# Altium schematic sheet Connector_ADC_Side.SchDoc
size B; Author: AVD; CompanyName: Pi-Radio; SheetNumber: 2; SheetTotal: 13
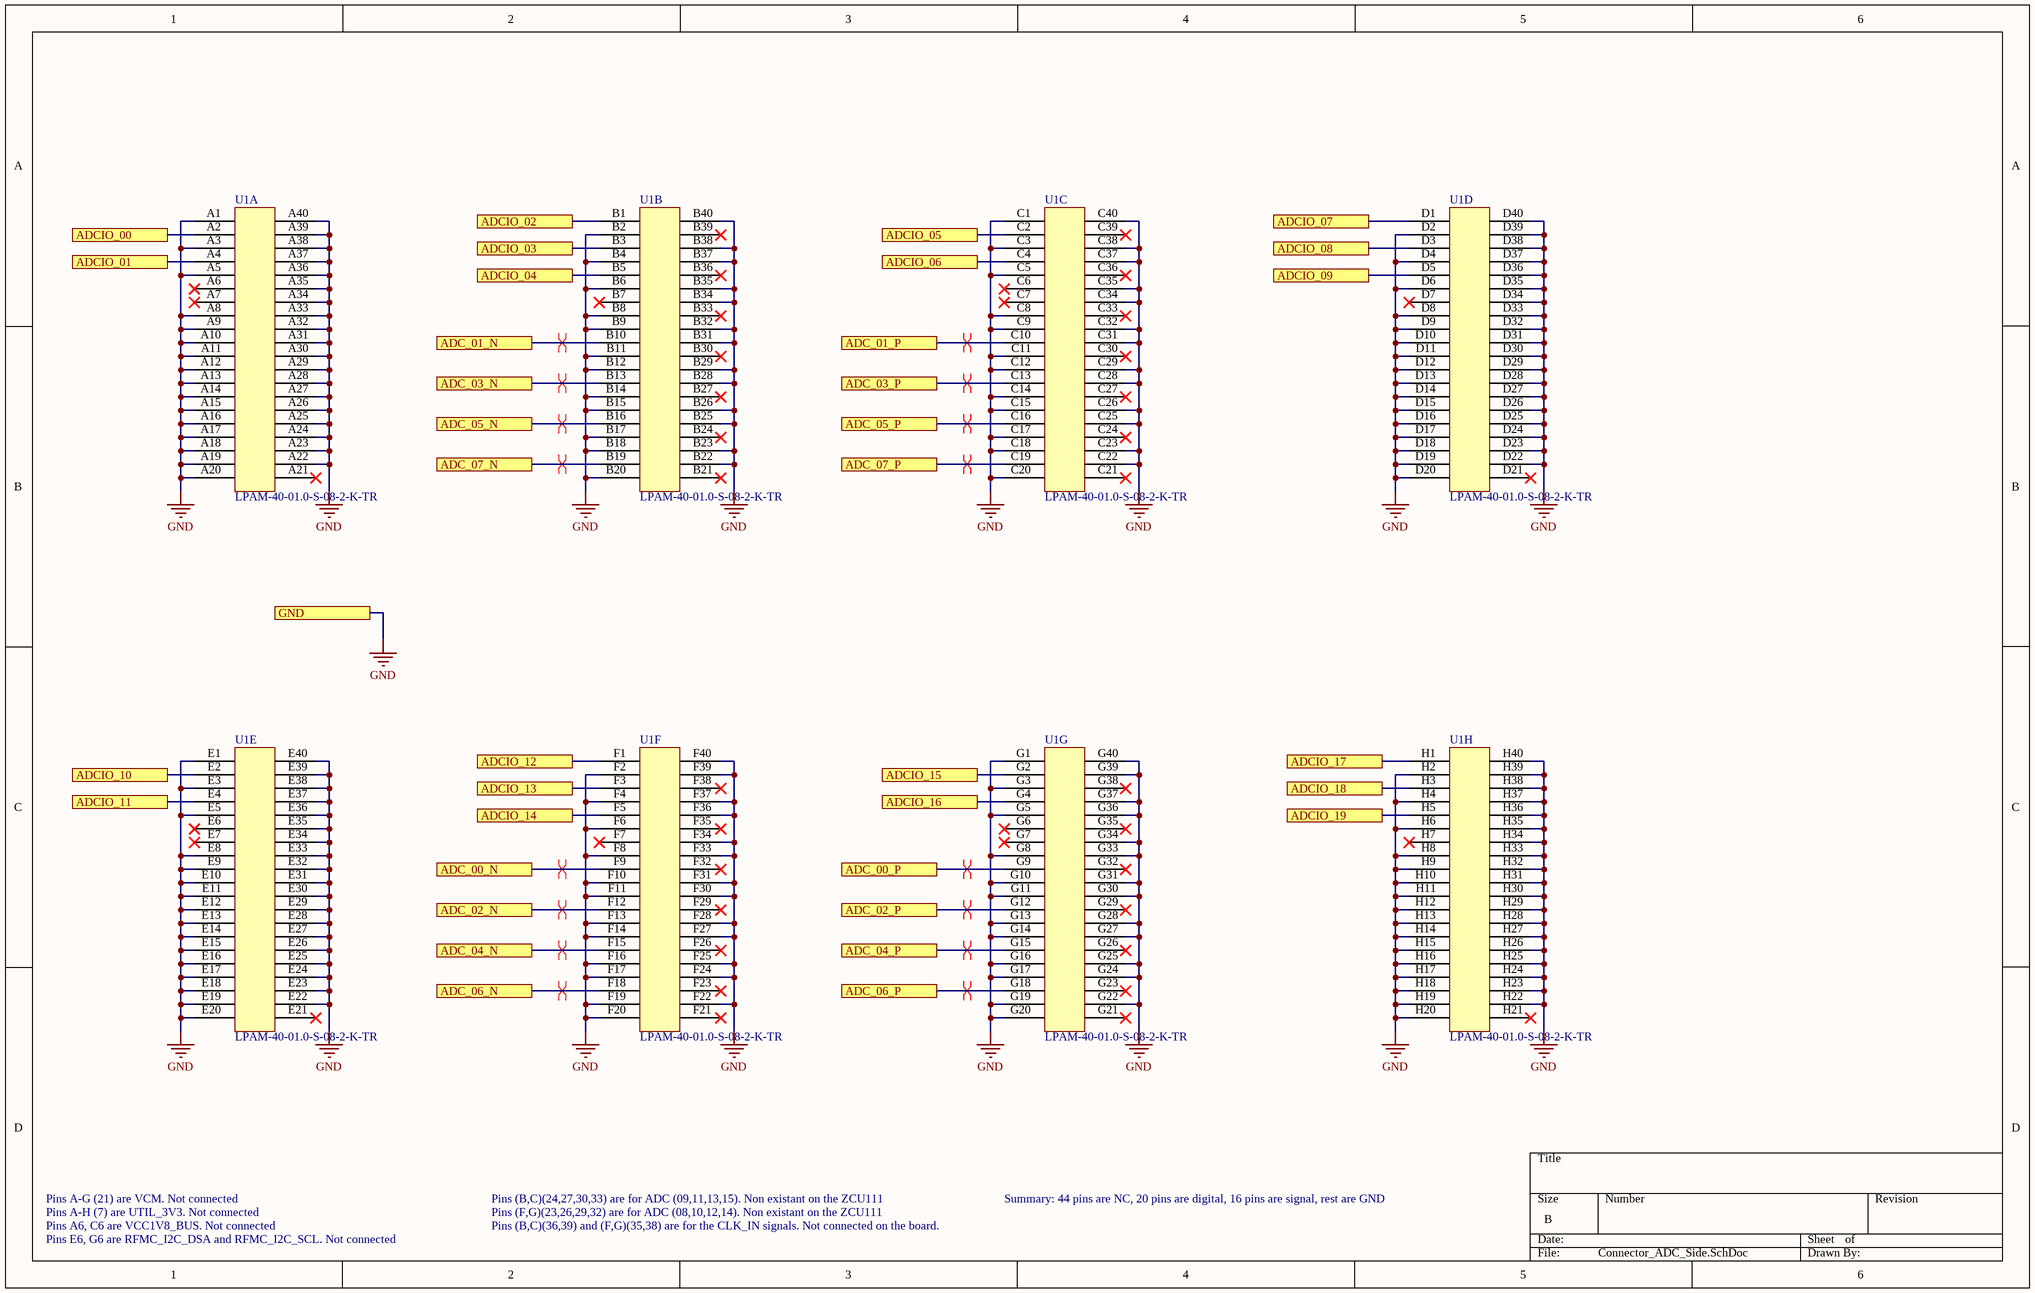
[diagram p0: Connector_ADC_Side.SchDoc]

## Parts
U1  LPAM-40-01.0-S-08-2-K-TR  [LPAM-40-01.5-S-08-2-K-TR]  (parts A,B,C,D,E,F,G,H of 8)

## Ports
ADC_00_N, ADC_00_P, ADC_01_N, ADC_01_P, ADC_02_N, ADC_02_P, ADC_03_N, ADC_03_P, ADC_04_N, ADC_04_P, ADC_05_N, ADC_05_P, ADC_06_N, ADC_06_P, ADC_07_N, ADC_07_P, ADCIO_00, ADCIO_01, ADCIO_02, ADCIO_03, ADCIO_04, ADCIO_05, ADCIO_06, ADCIO_07, ADCIO_08, ADCIO_09, ADCIO_10, ADCIO_11, ADCIO_12, ADCIO_13, ADCIO_14, ADCIO_15, ADCIO_16, ADCIO_17, ADCIO_18, ADCIO_19, GND

## Nets
GND: U1.A1 U1.A3 U1.A5 U1.A8 U1.A9 U1.A10 U1.A11 U1.A12 U1.A13 U1.A14 U1.A15 U1.A16 U1.A17 U1.A18 U1.A19 U1.A20 U1.A22 U1.A23 U1.A24 U1.A25 U1.A26 U1.A27 U1.A28 U1.A29 U1.A30 U1.A31 U1.A32 U1.A33 U1.A34 U1.A35 U1.A36 U1.A37 U1.A38 U1.A39 U1.A40 U1.B2 U1.B4 U1.B6 U1.B8 U1.B9 U1.B11 U1.B12 U1.B14 U1.B15 U1.B17 U1.B18 U1.B20 U1.B22 U1.B23 U1.B25 U1.B26 U1.B28 U1.B29 U1.B31 U1.B32 U1.B34 U1.B35 U1.B37 U1.B38 U1.B40 U1.C1 U1.C3 U1.C5 U1.C8 U1.C9 U1.C11 U1.C12 U1.C14 U1.C15 U1.C17 U1.C18 U1.C20 U1.C22 U1.C23 U1.C25 U1.C26 U1.C28 U1.C29 U1.C31 U1.C32 U1.C34 U1.C35 U1.C37 U1.C38 U1.C40 U1.D2 U1.D4 U1.D6 U1.D8 U1.D9 U1.D10 U1.D11 U1.D12 U1.D13 U1.D14 U1.D15 U1.D16 U1.D17 U1.D18 U1.D19 U1.D20 U1.D22 U1.D23 U1.D24 U1.D25 U1.D26 U1.D27 U1.D28 U1.D29 U1.D30 U1.D31 U1.D32 U1.D33 U1.D34 U1.D35 U1.D36 U1.D37 U1.D38 U1.D39 U1.D40 U1.E1 U1.E3 U1.E5 U1.E8 U1.E9 U1.E10 U1.E11 U1.E12 U1.E13 U1.E14 U1.E15 U1.E16 U1.E17 U1.E18 U1.E19 U1.E20 U1.E22 U1.E23 U1.E24 U1.E25 U1.E26 U1.E27 U1.E28 U1.E29 U1.E30 U1.E31 U1.E32 U1.E33 U1.E34 U1.E35 U1.E36 U1.E37 U1.E38 U1.E39 U1.E40 U1.F2 U1.F4 U1.F6 U1.F8 U1.F10 U1.F11 U1.F13 U1.F14 U1.F16 U1.F17 U1.F19 U1.F20 U1.F22 U1.F24 U1.F25 U1.F27 U1.F28 U1.F30 U1.F31 U1.F33 U1.F34 U1.F36 U1.F37 U1.F39 U1.F40 U1.G1 U1.G3 U1.G5 U1.G8 U1.G10 U1.G11 U1.G13 U1.G14 U1.G16 U1.G17 U1.G19 U1.G20 U1.G22 U1.G24 U1.G25 U1.G27 U1.G28 U1.G30 U1.G31 U1.G33 U1.G34 U1.G36 U1.G37 U1.G39 U1.G40 U1.H2 U1.H4 U1.H6 U1.H8 U1.H9 U1.H10 U1.H11 U1.H12 U1.H13 U1.H14 U1.H15 U1.H16 U1.H17 U1.H18 U1.H19 U1.H20 U1.H22 U1.H23 U1.H24 U1.H25 U1.H26 U1.H27 U1.H28 U1.H29 U1.H30 U1.H31 U1.H32 U1.H33 U1.H34 U1.H35 U1.H36 U1.H37 U1.H38 U1.H39 U1.H40 ; port GND
ADC_00_N: U1.F9 ; port ADC_00_N
ADC_00_P: U1.G9 ; port ADC_00_P
ADC_01_N: U1.B10 ; port ADC_01_N
ADC_01_P: U1.C10 ; port ADC_01_P
ADC_02_N: U1.F12 ; port ADC_02_N
ADC_02_P: U1.G12 ; port ADC_02_P
ADC_03_N: U1.B13 ; port ADC_03_N
ADC_03_P: U1.C13 ; port ADC_03_P
ADC_04_N: U1.F15 ; port ADC_04_N
ADC_04_P: U1.G15 ; port ADC_04_P
ADC_05_N: U1.B16 ; port ADC_05_N
ADC_05_P: U1.C16 ; port ADC_05_P
ADC_06_N: U1.F18 ; port ADC_06_N
ADC_06_P: U1.G18 ; port ADC_06_P
ADC_07_N: U1.B19 ; port ADC_07_N
ADC_07_P: U1.C19 ; port ADC_07_P
ADCIO_00: U1.A2 ; port ADCIO_00
ADCIO_01: U1.A4 ; port ADCIO_01
ADCIO_02: U1.B1 ; port ADCIO_02
ADCIO_03: U1.B3 ; port ADCIO_03
ADCIO_04: U1.B5 ; port ADCIO_04
ADCIO_05: U1.C2 ; port ADCIO_05
ADCIO_06: U1.C4 ; port ADCIO_06
ADCIO_07: U1.D1 ; port ADCIO_07
ADCIO_08: U1.D3 ; port ADCIO_08
ADCIO_09: U1.D5 ; port ADCIO_09
ADCIO_10: U1.E2 ; port ADCIO_10
ADCIO_11: U1.E4 ; port ADCIO_11
ADCIO_12: U1.F1 ; port ADCIO_12
ADCIO_13: U1.F3 ; port ADCIO_13
ADCIO_14: U1.F5 ; port ADCIO_14
ADCIO_15: U1.G2 ; port ADCIO_15
ADCIO_16: U1.G4 ; port ADCIO_16
ADCIO_17: U1.H1 ; port ADCIO_17
ADCIO_18: U1.H3 ; port ADCIO_18
ADCIO_19: U1.H5 ; port ADCIO_19

Not connected (* = marked no-connect by the designer): U1 A6* A7* A21* B7* B21* B24* B27* B30* B33* B36* B39* C6* C7* C21* C24* C27* C30* C33* C36* C39* D7* D21* E6* E7* E21* F7* F21* F23* F26* F29* F32* F35* F38* G6* G7* G21* G23* G26* G29* G32* G35* G38* H7* H21*

## Layout directives
differential pair: ADC_00_N, ADC_00_P, ADC_01_N, ADC_01_P, ADC_02_N, ADC_02_P, ADC_03_N, ADC_03_P, ADC_04_N, ADC_04_P, ADC_05_N, ADC_05_P, ADC_06_N, ADC_06_P, ADC_07_N, ADC_07_P

## Notes on the sheet
- Pins A-G (21) are VCM. Not connected
- Pins A-H (7) are UTIL_3V3. Not connected
- Pins A6, C6 are VCC1V8_BUS. Not connected
- Pins E6, G6 are RFMC_I2C_DSA and RFMC_I2C_SCL. Not connected
- Pins (B,C)(24,27,30,33) are for ADC (09,11,13,15). Non existant on the ZCU111
- Pins (F,G)(23,26,29,32) are for ADC (08,10,12,14). Non existant on the ZCU111
- Pins (B,C)(36,39) and (F,G)(35,38) are for the CLK_IN signals. Not connected on the board.
- Summary: 44 pins are NC, 20 pins are digital, 16 pins are signal, rest are GND

## Library data of the parts
U1 = LPAM-40-01.5-S-08-2-K-TR: .050" LP Array™ High-Speed High-Density Low Profile Open-Pin-Field Array, Terminal